# Altium project battery_Circuit.PrjPcb
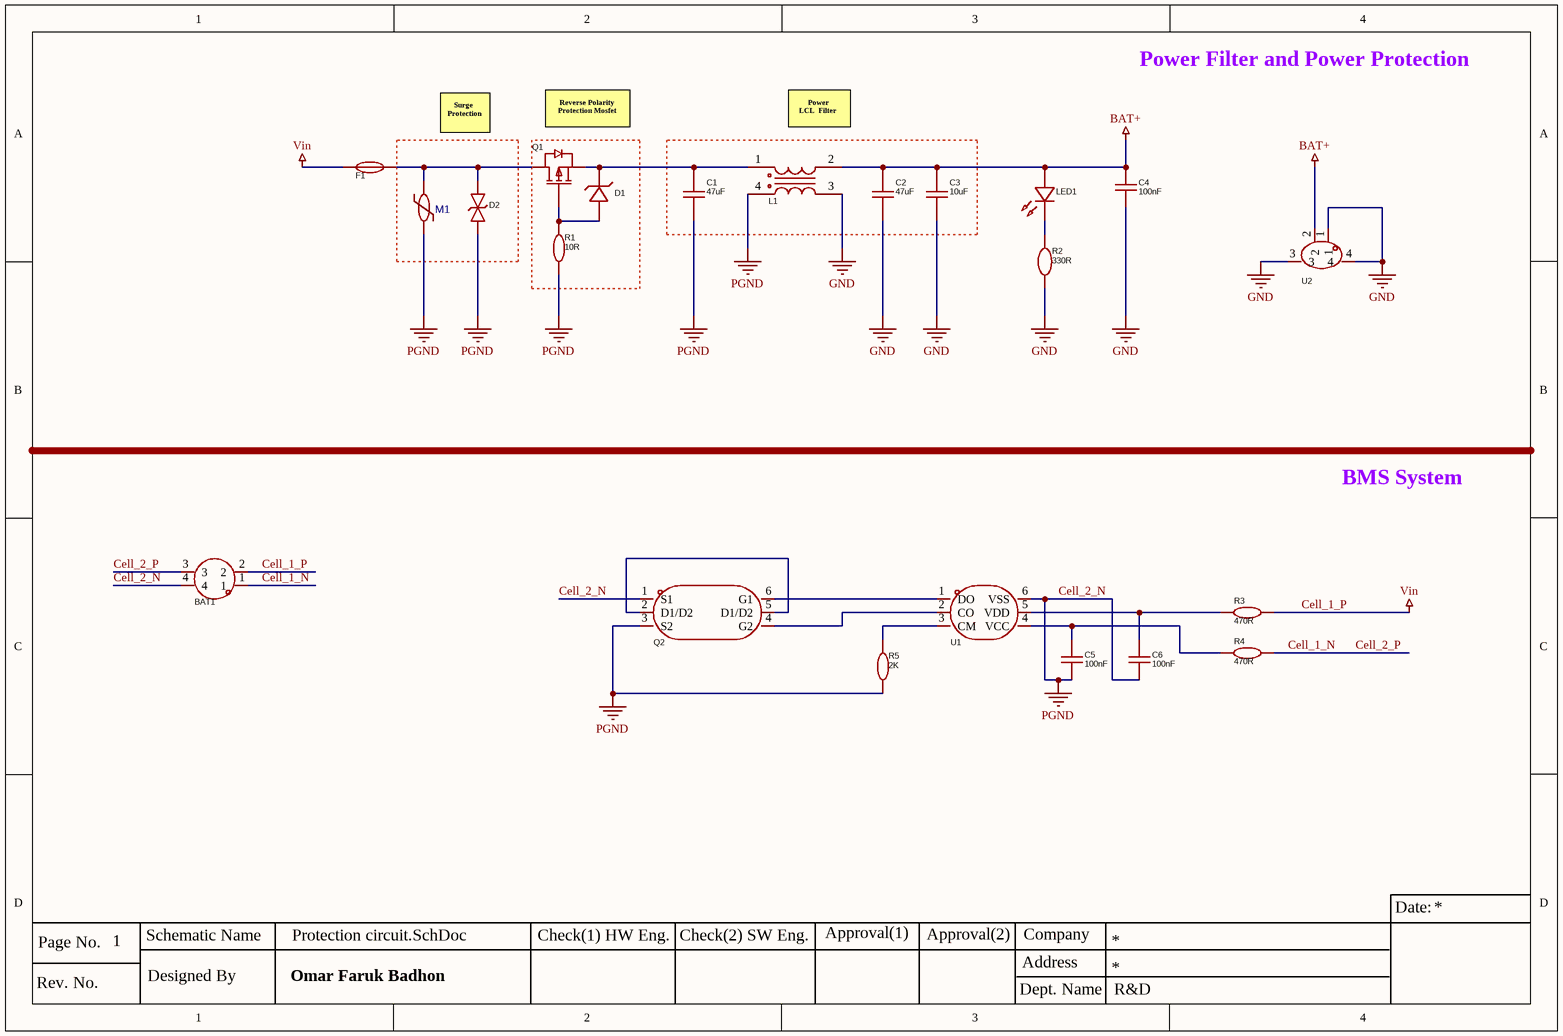
[diagram p0: Protection circuit.SchDoc]
1 sheet, 22 parts. Net scope: global (net labels, ports and power ports of the same name join across sheets).
Board file: Battery Circuit.PcbDoc

## Sheet Protection circuit.SchDoc
size A4; SheetNumber: 1; SheetTotal: 1

### Parts
BAT1  BH-18650-A1BJ021  [2 Cell Battery Case]  (value not drawn)
C1  47uF  [47uF Cap]
C2  47uF  [47uF Cap]
C3  10uF  [10uF Cap]
C4  100nF  [100nF Cap]
C5  100nF  [100nF Cap]
C6  100nF  [100nF Cap]
D1  BZT52B6V8  [Zener Diode]  (value not drawn)
D2  SDD32C24L01  [ESD Diode]  (value not drawn)
F1  C05228-000  [Fuse_2]  (value not drawn)
L1  CMF4532F-900-2P-Tms  [CMC Filter]  (value not drawn)
LED1  XL-1608SURC-06  [Led]  (value not drawn)
M1  EZJP0V270EA  [Varistor]  (value not drawn)
Q1  AO3401A  [P Mos]  (value not drawn)
Q2  FS8205A  [2 N Mos]  (value not drawn)
R1  10R  [10R Res]
R2  330R  [330R Res]
R3  470R  [470R Res]
R4  470R  [470R Res]
R5  2K  [2K Res]
U1  S-8252AAG-M6T1U  [BMS]  (value not drawn)
U2  BX-HA2.54-2PWT  [SMD JST 2P]  (value not drawn)

### Nets
BAT+: C2.2 C3.2 C4.2 L1.2 LED1.2(A) U2.2
Cell_1_P: BAT1.2 F1.1 R3.2  [also labelled Vin]
Cell_2_N: BAT1.4 C1.1 C5.1 C6.1 D2.1 L1.4 M1.1 Q2.1(S1) Q2.3(S2) R1.1 R5.1 U1.6(VSS)  [also labelled PGND]
GND: C2.1 C3.1 C4.1 L1.3 R2.1 U2.1 U2.3 U2.4
Cell_1_N: BAT1.1 BAT1.3 R4.2  [also labelled Cell_2_P]
NetC1_2: C1.2 D1.1(K) L1.1 Q1.2(S)
NetC5_2: C5.2 R4.1 U1.4(VCC)
NetC6_2: C6.2 R3.1 U1.5(VDD)
NetD1_2: D1.2(A) Q1.1(G) R1.2
NetD2_2: D2.2 F1.2 M1.2 Q1.3(D)
NetLED1_1: LED1.1(K) R2.2
NetQ2_2: Q2.2(D1/D2) Q2.5(D1/D2)
NetQ2_4: Q2.4(G2) U1.2(CO)
NetQ2_6: Q2.6(G1) U1.1(DO)
NetR5_2: R5.2 U1.3(CM)

### Notes on the sheet
- Power Filter and Power Protection
- Surge
  Protection
- Reverse Polarity Protection Mosfet
- Power
  LCL  Filter
- BMS System
- Date:
- Rev. No.
- Page No.
- Schematic Name
- Designed By
- Omar Faruk Badhon
- Check(1) HW Eng.
- Check(2) SW Eng.
- Approval(1)
- Approval(2)
- Address
- Company
- Dept. Name
- R&D

### Library data of the parts
BAT1 = 2 cell Battery Case: Manufacturer: MYOUNG(美阳); Add into BOM: yes; Connector Type: Battery box; Battery Type: CR18650; Symbol: BH-18650-A1BJ021; Device: BH-18650-A1BJ021; LCSC Part Name: 电池盒 适用电池:CR18650; Supplier Part: C20606804; Manufacturer Part: BH-18650-A1BJ021; Supplier Footprint: 插件; JLCPCB Part Class: Extended Part; Datasheet: https://atta.szlcsc.com/upload/public/pdf/source/20240112/147D77B47FAFC966051AFF7CD950677D.pdf; Supplier: LCSC; Convert to PCB: yes; Contact Plating: Nickel; Operating Temperature Range: -25℃~+85℃
C1 C2 = 47uF Res: Manufacturer: IHHEC(禾伸堂); Symbol: C1206B476M016T; Add into BOM: yes; Tolerance: ±20%; Device: C1206B476M016T; LCSC Part Name: 47uF ±20% 16V; Supplier Part: C607993; Manufacturer Part: C1206B476M016T; Supplier Footprint: 1206; JLCPCB Part Class: Extended Part; Datasheet: https://atta.szlcsc.com/upload/public/pdf/source/20190313/C374174_331C86E4A68CC9C732DA87186AAF7F8A.pdf; Supplier: LCSC; Convert to PCB: yes; Value: 47uF
C3 = 10uF Cap: Manufacturer: muRata(村田); Symbol: GRM32ER61C106KA12L; Add into BOM: yes; Tolerance: ±10%; Device: GRM32ER61C106KA12L; LCSC Part Name: 10uF ±10% 16V; Supplier Part: C184907; Manufacturer Part: GRM32ER61C106KA12L; Supplier Footprint: 1210; JLCPCB Part Class: Extended Part; Datasheet: https://atta.szlcsc.com/upload/public/pdf/source/20200305/C490387_23319AE8C154DEB24C505E6C82A8106A.pdf; Supplier: LCSC; Convert to PCB: yes; Value: 10uF
C4-C6 = 100nF Cap: Manufacturer: muRata(村田); Symbol: GRM188R71C104KA01D; Add into BOM: yes; Tolerance: ±10%; Device: GRM188R71C104KA01D; LCSC Part Name: 100nF ±10% 16V; Supplier Part: C45000; Manufacturer Part: GRM188R71C104KA01D; Supplier Footprint: 0603; JLCPCB Part Class: Extended Part; Datasheet: https://atta.szlcsc.com/upload/public/pdf/source/20161108/1478586365848.pdf; Supplier: LCSC; Convert to PCB: yes; Value: 100nF
D1 = Zener Diode: Manufacturer: FMS(美丽微); Device: BZT52B6V8_C213147; Add into BOM: yes; Diode Configuration: Single; Zener Voltage (Nom): 6.8V; Reverse Leakage Current (Ir): 2uA@4V; Zener Voltage (Range): 6.66V~6.94V; Power Dissipation: 350mW; Zener Impedance (Zzt): 15Ω; Symbol: BZT52B6V8; LCSC Part Name: BZT52B6V8; Supplier Part: C213147; Manufacturer Part: BZT52B6V8; Supplier Footprint: SOD-123; JLCPCB Part Class: Extended Part; Datasheet: https://atta.szlcsc.com/upload/public/pdf/source/20180504/C213215_D8AFED6AF7B069D42DB4E73D6157B86A.pdf; Supplier: LCSC; Convert to PCB: yes
D2 = ESD Diode: Manufacturer: Brightking(君耀电子); Add into BOM: yes; polarity: Bi-Directional; Reverse Stand-Off Voltage (Vrwm): 24V; Maximum Clamping Voltage: 43V; Peak Pulse Current (Ipp)@10/1000us: 1A; Breakdown Voltage: 26.7V; Number of Lines: 单路; Type: ESD; Symbol: SDD32C24L01; Device: SDD32C24L01; LCSC Part Name: 双向ESD; Supplier Part: C313315; Manufacturer Part: SDD32C24L01; Supplier Footprint: SOD-323; JLCPCB Part Class: Extended Part; Datasheet: https://atta.szlcsc.com/upload/public/pdf/source/20181015/C313315_2E77C22BCD6B5C9557E0D87DB90BD0FE.pdf; Supplier: LCSC; Convert to PCB: yes
F1 = Fuse_2: Manufacturer: Littelfuse(美国力特); Add into BOM: yes; Type: SMD Fuse; Current Rating: 5A; Voltage Rating (DC): 32V; Breaking Capacity: 45A; Symbol: C05228-000; Device: C05228-000; LCSC Part Name: 贴片式保险丝; Supplier Part: C207129; Manufacturer Part: C05228-000; Supplier Footprint: 1206; JLCPCB Part Class: Extended Part; Datasheet: https://atta.szlcsc.com/upload/public/pdf/source/20191009/C434710_3F89FEC5E8B25E469DD927D36E88D4C3.pdf; Supplier: LCSC; Convert to PCB: yes; Operating Temperature: -55℃~+125℃
L1 = CMC Filter: Manufacturer: EMTEK(兆欣); Add into BOM: yes; Number of Lines: 2; Withstanding Voltage: 12.5V; Current Rating: 2A; Voltage Rating - DC: 50V; Impedance @ Frequency: 90Ω@100MHz; DC Resistance (DCR): 50mΩ; Symbol: CMF4532F-900-2P-TMS; Device: CMF4532F-900-2P-Tms; LCSC Part Name: 两路 贴片共模滤波器 阻抗90Ω@100MHz; Supplier Part: C252150; Manufacturer Part: CMF4532F-900-2P-Tms; Supplier Footprint: SMD,4.5x3.2x2.8mm; JLCPCB Part Class: Extended Part; Datasheet: https://atta.szlcsc.com/upload/public/pdf/source/20190322/C252150_370767FB0BF4DE5D3F867A1ABBD704E0.pdf; Supplier: LCSC; Convert to PCB: yes; Operating Temperature: -40℃~+125℃
LED1 = Led: Manufacturer: XINGLIGHT(成兴光); Add into BOM: yes; Emitted Color: Red; Power Dissipation: 55mW; Forward Current: 25mA; Dominant Wavelength: 617nm~621nm; Peak Wavelength: 623nm; Lens Color: 无色透明透镜; Viewing Angle: 120°; Mounting Sytle: Positive post; Symbol: XL-1608SURC-06; Device: XL-1608SURC-06; LCSC Part Name: XL-1608SURC-06; Supplier Part: C965799; Manufacturer Part: XL-1608SURC-06; Supplier Footprint: 0603; JLCPCB Part Class: Extended Part; Datasheet: https://atta.szlcsc.com/upload/public/pdf/source/20221102/D860AFDD1CDB02C5A8064103A32707E2.pdf; Supplier: LCSC; Convert to PCB: yes; Color Temperature: -; Operating Temperature: -30℃~+85℃
M1 = Varistor: Manufacturer: PANASONIC(松下); Contributor: LCSC; Supplier: LCSC; Supplier Part: C336822; Manufacturer Part: EZJP0V270EA; JLCPCB Part Class: Extended Part; spicePre: R; spiceSymbolName: EZJP0V270EA
Q1 = P Mos: Manufacturer: AOS; Device: AO3401A_C15127; Add into BOM: yes; Type: 1个PChannel; Drain Source On Resistance (RDS(on)@Vgs,Id): 44mΩ@10V,4.3A; Gate Threshold Voltage (Vgs(th)@Id): 1.3V@250uA; Total Gate Charge (Qg@Vgs): 12.2nC@4.5V; Input Capacitance (Ciss@Vds): 1.2nF@15V; Symbol: AO3401A; LCSC Part Name: 1个P沟道 耐压:30V 电流:4A; Supplier Part: C15127; Manufacturer Part: AO3401A; Supplier Footprint: SOT-23; JLCPCB Part Class: Basic Part; Datasheet: https://atta.szlcsc.com/upload/public/pdf/source/20160507/1462613609053.pdf; Supplier: LCSC; Convert to PCB: yes; Operating Temperature: -55℃~+150℃@(Tj)
Q2 = 2 N Mos: Manufacturer: TECH PUBLIC(台舟); Symbol: FS8205A_C2830320; Add into BOM: yes; Type: 2 N-Channel; Drain Source On Resistance (RDS(on)@Vgs,Id): 19.5mΩ@4.5V,3A; Gate Threshold Voltage (Vgs(th)@Id): 700mV@250uA; Total Gate Charge (Qg@Vgs): 5.7nC@10V; Input Capacitance (Ciss@Vds): 466pF@10V; Reverse Transfer Capacitance (Crss@Vds): 58pF@10V; Device: FS8205A_C2830320; LCSC Part Name: 2个N沟道 耐压:20V 电流:6A; Supplier Part: C2830320; Manufacturer Part: FS8205A; Supplier Footprint: SOT-23-6; JLCPCB Part Class: Extended Part; Datasheet: https://atta.szlcsc.com/upload/public/pdf/source/20210810/F53B6D4E8755A1F8E11BAF814CE98E6A.pdf; Supplier: LCSC; Convert to PCB: yes; Operating Temperature: -55℃~+150℃@(Tj)
R1 = 10R Res: Manufacturer: FH(风华); Symbol: RS-03K100JT; Add into BOM: yes; Value: 10Ω; Tolerance: ±5%; Temperature Coefficient: ±100ppm/℃; Device: RS-03K100JT; LCSC Part Name: 厚膜电阻 10Ω ±5% 100mW; Supplier Part: C304686; Manufacturer Part: RS-03K100JT; Supplier Footprint: 0603; JLCPCB Part Class: Extended Part; Datasheet: https://atta.szlcsc.com/upload/public/pdf/source/20190505/C118335_36085569433BA7FFC796E569DBFE3139.pdf; Supplier: LCSC; Convert to PCB: yes; Type: Thick Film Resistors; Operating Temperature Range: -55℃~+155℃
R2 = 330R Res: Manufacturer: PANASONIC(松下); Symbol: ERJPA2F3300X; Add into BOM: yes; Value: 330Ω; Tolerance: ±1%; Temperature Coefficient: ±100ppm/℃; Device: ERJPA2F3300X; LCSC Part Name: 330Ω ±1% 200mW 厚膜电阻; Supplier Part: C427237; Manufacturer Part: ERJPA2F3300X; Supplier Footprint: 0402; JLCPCB Part Class: Extended Part; Supplier: LCSC; Convert to PCB: yes; Type: Thick Film Resistors; Overload Voltage (Max): -; Operating Temperature Range: -55℃~+155℃
R3 R4 = 470R Res: Manufacturer: LIZ(丽智电子); Symbol: CR0402FF4700G; Add into BOM: yes; Value: 470Ω; Tolerance: ±1%; Temperature Coefficient: ±200ppm/℃; Device: CR0402FF4700G; LCSC Part Name: 厚膜电阻 470Ω ±1% 62.5mW; Supplier Part: C100443; Manufacturer Part: CR0402FF4700G; Supplier Footprint: 0402; JLCPCB Part Class: Extended Part; Datasheet: https://atta.szlcsc.com/upload/public/pdf/source/20180403/C189438_6D658388CC7843F35BBC9018D03F0B8E.pdf; Supplier: LCSC; Convert to PCB: yes; Type: Thick Film Resistors; Operating Temperature Range: -55℃~+125℃
R5 = 2K Res: Manufacturer: FH(风华); Symbol: RC-02W2001FT; Add into BOM: yes; Value: 2kΩ; Tolerance: ±1%; Temperature Coefficient: ±200ppm/℃; Device: RC-02W2001FT; LCSC Part Name: 厚膜电阻 2kΩ ±1% 62.5mW; Supplier Part: C304583; Manufacturer Part: RC-02W2001FT; Supplier Footprint: 0402; JLCPCB Part Class: Extended Part; Datasheet: https://atta.szlcsc.com/upload/public/pdf/source/20190505/C118335_36085569433BA7FFC796E569DBFE3139.pdf; Supplier: LCSC; Convert to PCB: yes; Type: Thick Film Resistors; Operating Temperature Range: -55℃~+155℃
U1 = BMS: Manufacturer: ABLIC(艾普凌科); Add into BOM: yes; The Chip Type: 电池保护芯片; Type of Battery: 锂离子/Polymer; Number of Cells: 2; Symbol: S-8252AAG-M6T1U; Device: S-8252AAG-M6T1U; LCSC Part Name: S-8252AAG-M6T1U; Supplier Part: C468221; Manufacturer Part: S-8252AAG-M6T1U; Supplier Footprint: SOT-23-6; JLCPCB Part Class: Extended Part; Datasheet: https://atta.szlcsc.com/upload/public/pdf/source/20191209/C468225_F5C4BE1FF1893F617C569592E38D23FF.pdf; Supplier: LCSC; Convert to PCB: yes; Operating Temperature: -40℃~+85℃
U2 = SMD JST: Manufacturer: Bossie(博锡); Add into BOM: yes; Pins Structure: 1x2P; Pitch: 2.54mm; Number of PINs Per Row: 2; Current Rating (Max): 3A; Symbol: BX-HA2.54-2PWT; Device: BX-HA2.54-2PWT; LCSC Part Name: 1x2P 间距:2.54mm 卧贴; Supplier Part: C18077806; Manufacturer Part: BX-HA2.54-2PWT; Supplier Footprint: SMD,P=2.54mm,卧贴; JLCPCB Part Class: Extended Part; Datasheet: https://atta.szlcsc.com/upload/public/pdf/source/20231017/0F5BE3E474C97FE56F69CCCD4551F1BC.pdf; Supplier: LCSC; Convert to PCB: yes; Mounting Style: 卧贴; Reference Series: -; Number of Pins: 2P; Number of Rows: 1; Row Spacing: -; Contact Material: Brass; Contact Plating: Tin; Operating Temperature Range: -25℃~+85℃